# Altium schematic sheet MiniBoard.SchDoc
size A4
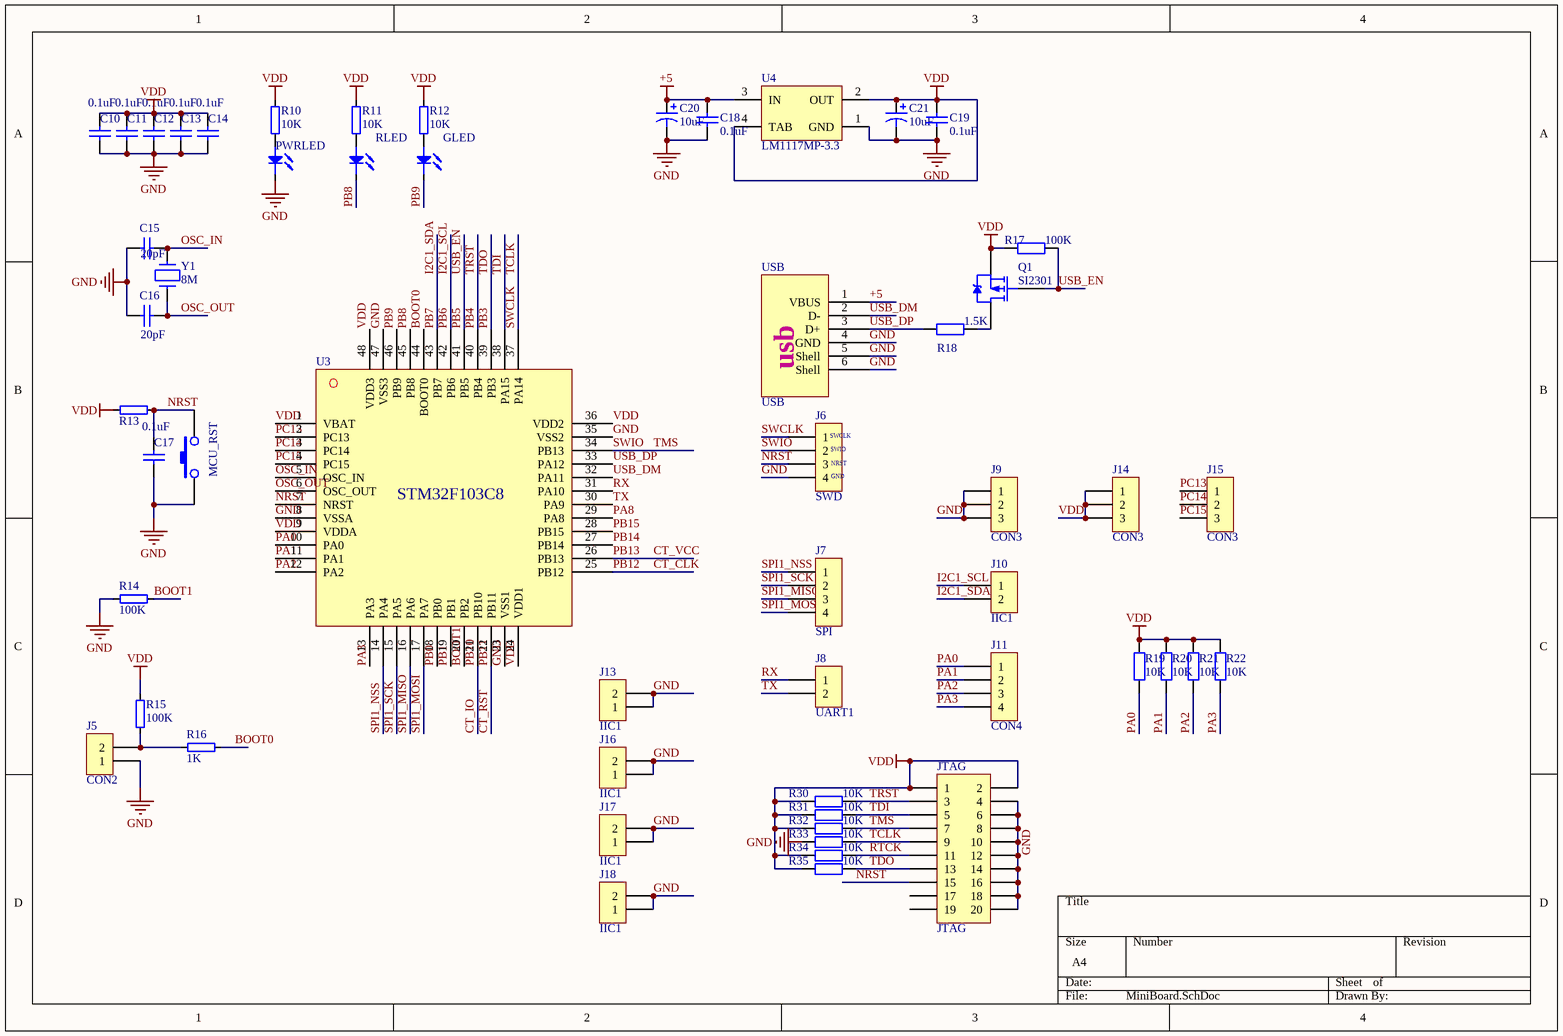
[diagram p0: MiniBoard.SchDoc]

## Parts
C10  0.1uF  [C0603]
C11  0.1uF  [C0603]
C12  0.1uF  [C0603]
C13  0.1uF  [C0603]
C14  0.1uF  [C0603]
C15  20pF  [C0603]
C16  20pF  [C0603]
C17  0.1uF  [C0603]
C18  0.1uF  [C0603]
C19  0.1uF  [C0603]
C20  10uF  [1210-A]
C21  10uF  [1210-A]
GLED  LED  [LED0805]  (value not drawn)
J5  CON2  [HDR1X2]
J6  SWD  [SWD]
J7  SPI  [HDR1X4]
J8  UART1  [HDR1X2]
J9  CON3  [HDR1X3]
J10  IIC1  [HDR1X2]
J11  CON4  [HDR1X4]
J13  IIC1  [HDR1X2]
J14  CON3  [HDR1X3]
J15  CON3  [HDR1X3]
J16  IIC1  [HDR1X2]
J17  IIC1  [HDR1X2]
J18  IIC1  [HDR1X2]
JTAG  JTAG  [HDR2X10]
MCU_RST  BUTTON  [BUTTON-S]  (value not drawn)
PWRLED  LED  [LED0805]  (value not drawn)
Q1  SI2301  [SOT-23-2301]
R10  10K  [R0603]
R11  10K  [R0603]
R12  10K  [R0603]
R13  10K  [R0603]  (value not drawn)
R14  100K  [R0603]
R15  100K  [R0603]
R16  1K  [R0603]
R17  100K  [R0603]
R18  1.5K  [R0603]
R19  10K  [R0603]
R20  10K  [R0603]
R21  10K  [R0603]
R22  10K  [R0603]
R30  10K  [R0603]
R31  10K  [R0603]
R32  10K  [R0603]
R33  10K  [R0603]
R34  10K  [R0603]
R35  10K  [R0603]
RLED  LED  [LED0805]  (value not drawn)
U3  STM32F103C8  [LQFP48_N]  (value not drawn)
U4  LM1117MP-3.3  [MP04A_L]
USB  USB  [USB-B]
Y1  8M  [XTAL]

## Nets
+5: C18.2 C20.1 U4.3(IN) USB.1(VBUS)
GND: C10.1 C11.1 C12.1 C13.1 C14.1 C15.2 C16.2 C17.1 C18.1 C19.1 C20.2 C21.2 J5.1 J6.4 J9.1 J9.2 J9.3 J13.1 J13.2 J16.1 J16.2 J17.1 J17.2 J18.1 J18.2 JTAG.4 JTAG.6 JTAG.8 JTAG.10 JTAG.12 JTAG.14 JTAG.16 JTAG.18 JTAG.20 MCU_RST.1 PWRLED.2 R14.2 R33.2 U3.8(VSSA) U3.23(VSS1) U3.35(VSS2) U3.47(VSS3) U4.1(GND) USB.4(GND) USB.5(Shell) USB.6(Shell)
VDD: C10.2 C11.2 C12.2 C13.2 C14.2 C19.2 C21.1 J14.1 J14.2 J14.3 JTAG.1 JTAG.2 Q1.3(S) R10.1 R11.2 R12.2 R13.1 R15.2 R17.1 R19.1 R20.1 R21.1 R22.1 R30.1 R31.1 R32.1 R34.1 R35.1 U3.1(VBAT) U3.9(VDDA) U3.24(VDD1) U3.36(VDD2) U3.48(VDD3) U4.2(OUT) U4.4(TAB)
BOOT0: R16.1 U3.44(BOOT0)
BOOT1: R14.1 U3.20(PB2)
CT_CLK: U3.25(PB12)  [also labelled PB12]
CT_IO: U3.21(PB10)  [also labelled PB10]
CT_RST: U3.22(PB11)  [also labelled PB11]
CT_VCC: U3.26(PB13)  [also labelled PB13]
I2C1_SCL: J10.1 U3.42(PB6)  [also labelled PB6]
I2C1_SDA: J10.2 U3.43(PB7)  [also labelled PB7]
NRST: C17.2 J6.3 JTAG.15 MCU_RST.2 R13.2 U3.7(NRST)
OSC_IN: C15.1 U3.5(OSC_IN) Y1.1
OSC_OUT: C16.1 U3.6(OSC_OUT) Y1.2
PA0: J11.1 R19.2 U3.10(PA0)
PA1: J11.2 R20.2 U3.11(PA1)
PA2: J11.3 R21.2 U3.12(PA2)
PA3: J11.4 R22.2 U3.13(PA3)
PA8: U3.29(PA8)
PB0: U3.18(PB0)
PB1: U3.19(PB1)
PB3: JTAG.13 R35.2 U3.39(PB3)  [also labelled TDO]
PB4: JTAG.3 R30.2 U3.40(PB4)  [also labelled TRST]
PB5: Q1.1(G) R17.2 U3.41(PB5)  [also labelled USB_EN]
PB8: RLED.2 U3.45(PB8)
PB9: GLED.2 U3.46(PB9)
PB14: U3.27(PB14)
PB15: U3.28(PB15)
PC13: J15.1 U3.2(PC13)
PC14: J15.2 U3.3(PC14)
PC15: J15.3 U3.4(PC15)
RTCK: JTAG.11 R34.2
RX: J8.1 U3.31(PA10)
SPI1_MISO: J7.3 U3.16(PA6)
SPI1_MOSI: J7.4 U3.17(PA7)
SPI1_NSS: J7.1 U3.14(PA4)
SPI1_SCK: J7.2 U3.15(PA5)
SWCLK: J6.1 JTAG.9 R33.1 U3.37(PA14)  [also labelled TCLK]
SWIO: J6.2 JTAG.7 R32.2 U3.34(PB13)  [also labelled TMS]
TDI: JTAG.5 R31.2 U3.38(PA15)
TX: J8.2 U3.30(PA9)
USB_DM: U3.32(PA11) USB.2(D-)
USB_DP: R18.1 U3.33(PA12) USB.3(D+)
NetGLED_1: GLED.1 R12.1
NetJ5_2: J5.2 R15.1 R16.2
NetPWRLED_1: PWRLED.1 R10.2
NetQ1_2: Q1.2(D) R18.2
NetR11_1: R11.1 RLED.1

Not connected (* = marked no-connect by the designer): JTAG 17 19

## Notes on the sheet
- (in symbol SWD) SWCLK; SWIO; NRST; GND
- (in symbol USB) usb

## Library data of the parts
C10-C17 = CAP: Capacitor; Published: 8-Jun-2000; LatestRevisionDate: 17-Jul-2002; LatestRevisionNote: Re-released for DXP Platform.; PackageReference: RAD-0.3; Publisher: Altium Limited
  C10-C14 C17: Value: 0.1uF
  C15 C16: Value: 20pF
C18 C19 = Cap: Capacitor; Published: 8-Jun-2000; LatestRevisionDate: 17-Jul-2002; LatestRevisionNote: Re-released for DXP Platform.; PackageReference: 0805; Publisher: Altium Limited; Value: 0.1uF
C20 C21 = Cap Pol1: Polarized Capacitor (Radial); Published: 8-Jun-2000; LatestRevisionDate: 17-Jul-2002; LatestRevisionNote: Re-released for DXP Platform.; PackageReference: 0805; Publisher: Altium Limited; Value: 10uF
J5 J8 J10 J13 J16-J18 = CON2: Connector
J6 = SWD: Connector
J7 = CON4: USART
J9 J14 J15 = CON3: Connector
J11 = CON4: Connector
JTAG = Header 10X2: Header, 10-Pin, Dual row; LatestRevisionDate: 17-Jul-2002; LatestRevisionNote: Re-released for DXP Platform.; Publisher: Altium Limited
Q1 = PMOS-2: P-Channel Power MOSFET; pin to pad: 2>3 3>2; Note: Pin 4 not drawn and electrically connected to Pin 2.; Published: 8-Jun-2000; LatestRevisionDate: 17-Jul-2002; LatestRevisionNote: Re-released for DXP Platform.; DatasheetDocument: PD-9.390D; PackageReference: SOT-23-2301; Publisher: Altium Limited; Code_JEDEC: TO-220-AB; ComponentLink1Description: Manufacturer Link; ComponentLink1URL: http://www.irf.com/
R10-R16 = RES
R17 R18 R30-R35 = Res2: Resistor; Published: 8-Jun-2000; LatestRevisionDate: 17-Jul-2002; LatestRevisionNote: Re-released for DXP Platform.; PackageReference: 0805; Publisher: Altium Limited
  R17: Value: 100K
  R18: Value: 1.5K
  R30-R35: Value: 10K
R19-R22 = R: Value: 1K; Published: 8-Jun-2000; LatestRevisionDate: 17-Jul-2002; LatestRevisionNote: Re-released for DXP Platform.; PackageReference: AXIAL-0.4; Publisher: Altium Limited; PackageDescription: Axial Device, Thru-Hole; 2 Leads; 0.4 in Pin Spacing
U4 = LM1117MP-3.3: 800mA Low-Dropout Linear Regulator; Manufacturer: National Semiconductor; CompType: LDO IC; PackageTopMarking: XYTT*N05A; Published: 27-Nov-2008; DatasheetVersion: Apr-2006; PackageVersion: revB, Apr-2003; PackageReference: MP04A; Publisher: Altium Limited; PackageDescription: Molded SOT-223, 6.50 x 3.56 x 1.6mm Body, 4 Lead, 2.3mm Pitch; PartNumber: LM1117MP-3.3; RoHS: O; PinCount: 4; DigiKeyPartNumber: LM1117MP-3.3CT-ND; Code_JEDEC: TO-261-AA; Code_IPC: SOT223-4; ComponentLink1Description: LM1117 Datasheet; ComponentLink1URL: http://www.national.com/ds/LM/LM1117.pdf; ComponentLink2Description: LM1117 Web Page; ComponentLink2URL: http://www.national.com/pf/LM/LM1117.html; ComponentLink3Description: MP04A Package Page; ComponentLink3URL: http://www.national.com/packaging/folders/mp04a.html
Y1 = CRYSTAL